# Altium project Mini51.PrjPCB
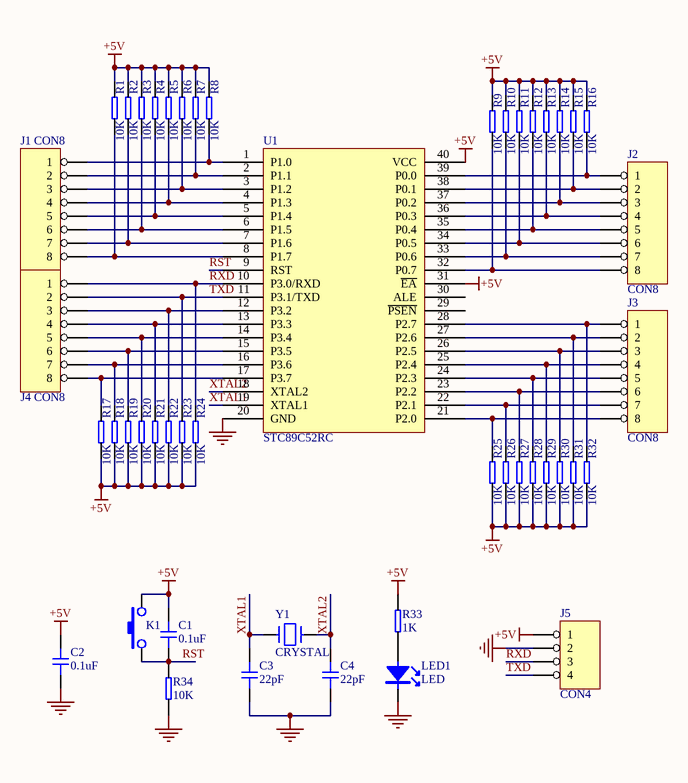
[diagram p0: Mini51.SchDoc]
1 sheet, 47 parts. Net scope: global (net labels, ports and power ports of the same name join across sheets).
Board file: Mini51.PcbDoc

## Sheet Mini51.SchDoc
size 203 x 177 mm

### Parts
C1  0.1uF  [0805]
C2  0.1uF  [0805]
C3  22pF  [0805]
C4  22pF  [0805]
J1  CON8  [SIP8]
J2  CON8  [SIP8]
J3  CON8  [SIP8]
J4  CON8  [SIP8]
J5  CON4  [SIP4]
K1  KEY  [KEY-6*6]  (value not drawn)
LED1  LED  [0805LD]
R1  10K  [0805]
R2  10K  [0805]
R3  10K  [0805]
R4  10K  [0805]
R5  10K  [0805]
R6  10K  [0805]
R7  10K  [0805]
R8  10K  [0805]
R9  10K  [0805]
R10  10K  [0805]
R11  10K  [0805]
R12  10K  [0805]
R13  10K  [0805]
R14  10K  [0805]
R15  10K  [0805]
R16  10K  [0805]
R17  10K  [0805]
R18  10K  [0805]
R19  10K  [0805]
R20  10K  [0805]
R21  10K  [0805]
R22  10K  [0805]
R23  10K  [0805]
R24  10K  [0805]
R25  10K  [0805]
R26  10K  [0805]
R27  10K  [0805]
R28  10K  [0805]
R29  10K  [0805]
R30  10K  [0805]
R31  10K  [0805]
R32  10K  [0805]
R33  1K  [0805]
R34  10K  [0805]
U1  STC89C52RC  [DIP40]
Y1  CRYSTAL  [XTAL-2]

### Nets
+5V: C1.2 C2.2 J5.1 K1.2 R1.2 R2.2 R3.2 R4.2 R5.2 R6.2 R7.2 R8.2 R9.2 R10.2 R11.2 R12.2 R13.2 R14.2 R15.2 R16.2 R17.1 R18.1 R19.1 R20.1 R21.1 R22.1 R23.1 R24.1 R25.1 R26.1 R27.1 R28.1 R29.1 R30.1 R31.1 R32.1 R33.2 U1.31(~{EA}) U1.40(VCC)
GND: C2.1 C3.1 C4.1 J5.2 LED1.K R34.1 U1.20(GND)
RST: C1.1 K1.1 R34.2 U1.9(RST)
RXD: J4.1 J5.3 R24.2 U1.10(P3.0/RXD)
TXD: J4.2 J5.4 R23.2 U1.11(P3.1/TXD)
XTAL1: C3.2 U1.19(XTAL1) Y1.1
XTAL2: C4.2 U1.18(XTAL2) Y1.2
NetJ1_1: J1.1 R8.1 U1.1(P1.0)
NetJ1_2: J1.2 R7.1 U1.2(P1.1)
NetJ1_3: J1.3 R6.1 U1.3(P1.2)
NetJ1_4: J1.4 R5.1 U1.4(P1.3)
NetJ1_5: J1.5 R4.1 U1.5(P1.4)
NetJ1_6: J1.6 R3.1 U1.6(P1.5)
NetJ1_7: J1.7 R2.1 U1.7(P1.6)
NetJ1_8: J1.8 R1.1 U1.8(P1.7)
NetJ2_1: J2.1 R16.1 U1.39(P0.0)
NetJ2_2: J2.2 R15.1 U1.38(P0.1)
NetJ2_3: J2.3 R14.1 U1.37(P0.2)
NetJ2_4: J2.4 R13.1 U1.36(P0.3)
NetJ2_5: J2.5 R12.1 U1.35(P0.4)
NetJ2_6: J2.6 R11.1 U1.34(P0.5)
NetJ2_7: J2.7 R10.1 U1.33(P0.6)
NetJ2_8: J2.8 R9.1 U1.32(P0.7)
NetJ3_1: J3.1 R32.2 U1.28(P2.7)
NetJ3_2: J3.2 R31.2 U1.27(P2.6)
NetJ3_3: J3.3 R30.2 U1.26(P2.5)
NetJ3_4: J3.4 R29.2 U1.25(P2.4)
NetJ3_5: J3.5 R28.2 U1.24(P2.3)
NetJ3_6: J3.6 R27.2 U1.23(P2.2)
NetJ3_7: J3.7 R26.2 U1.22(P2.1)
NetJ3_8: J3.8 R25.2 U1.21(P2.0)
NetJ4_3: J4.3 R22.2 U1.12(P3.2)
NetJ4_4: J4.4 R21.2 U1.13(P3.3)
NetJ4_5: J4.5 R20.2 U1.14(P3.4)
NetJ4_6: J4.6 R19.2 U1.15(P3.5)
NetJ4_7: J4.7 R18.2 U1.16(P3.6)
NetJ4_8: J4.8 R17.2 U1.17(P3.7)
NetLED1_A: LED1.A R33.1

Not connected (* = marked no-connect by the designer): U1 29(~{PSEN}) 30(ALE)

### Library data of the parts
C1-C4 = CAP
J1-J4 = CON8: Connector 8p
K1 = KEY: push-button
LED1 = LED: Light-Emitting Diode
R1-R34 = RES
U1 = STC89C52